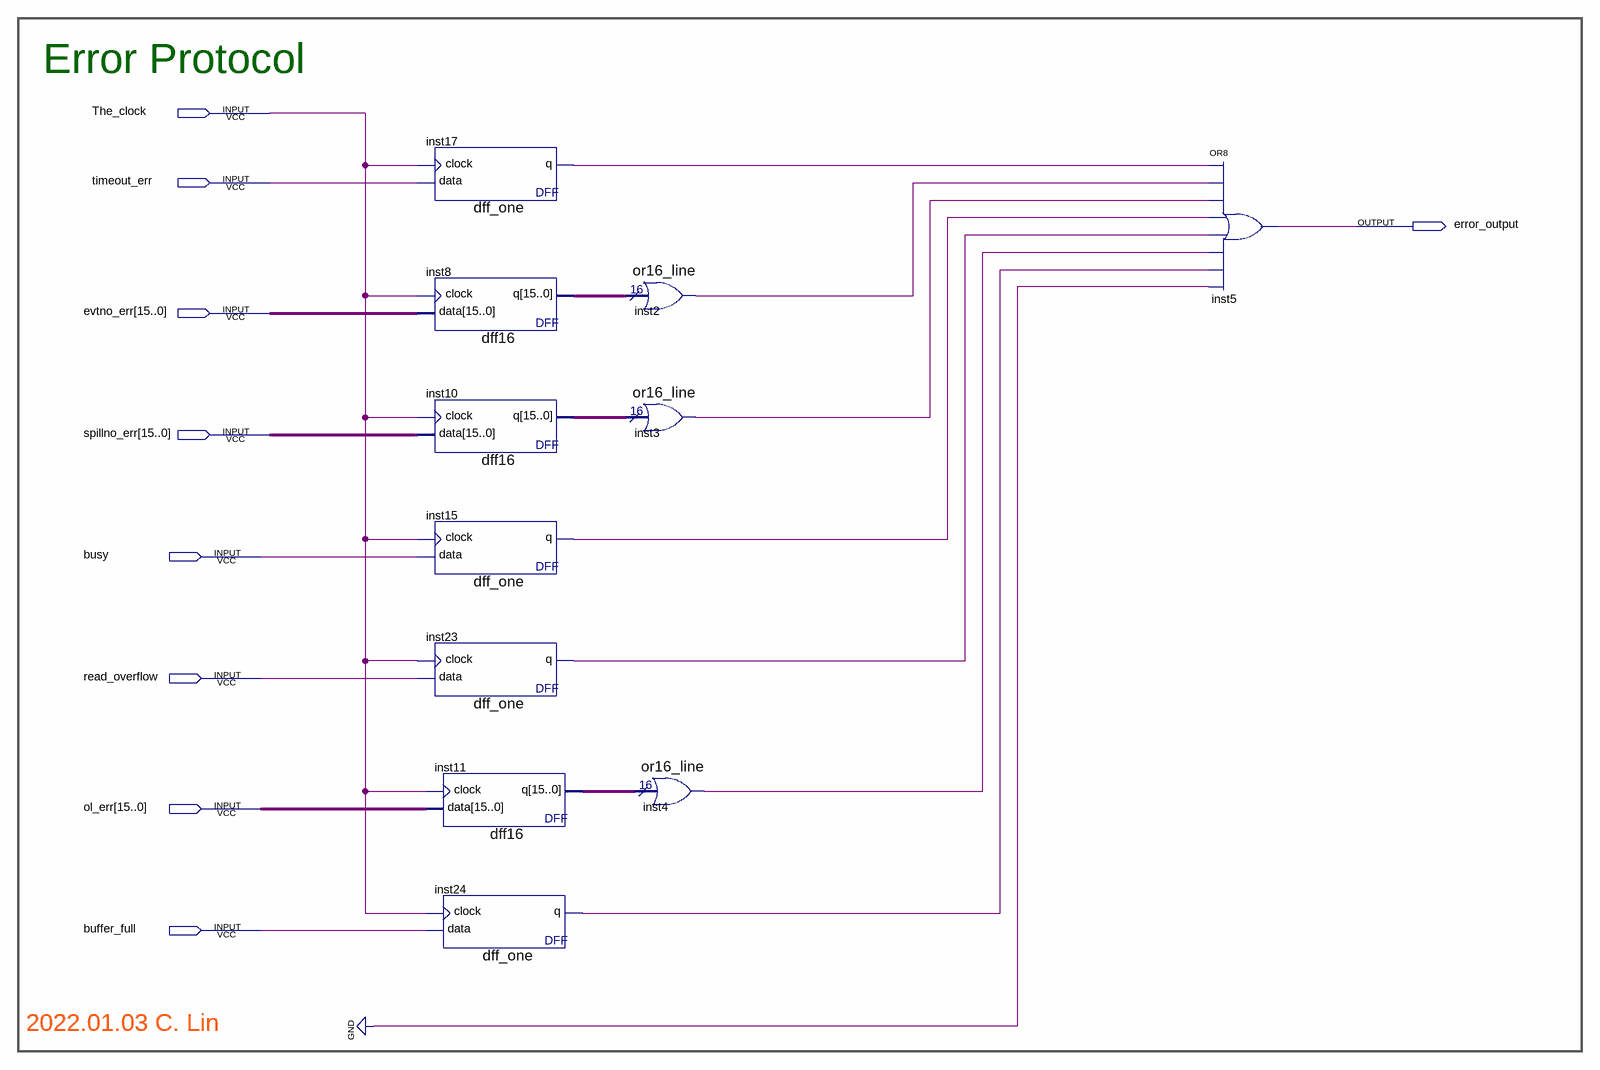
[diagram p0: schematic sheet]
// Quartus schematic error_protocol.bdf as structural Verilog: 11 symbols, 9 pins
module error_protocol (
  input  The_clock,
  input  timeout_err,
  input  [15:0] evtno_err,
  input  [15:0] spillno_err,
  input  busy,
  input  read_overflow,
  input  [15:0] ol_err,
  input  buffer_full,
  output error_output
);

  wire inst2_result, inst3_result, inst4_result, inst15_q, inst17_q, inst23_q, inst24_q;
  wire [15:0] inst8_q, inst10_q, inst11_q;

  dff_one inst17 (.data(timeout_err), .clock(The_clock), .q(inst17_q));
  dff16 inst8 (.data(evtno_err), .clock(The_clock), .q(inst8_q));
  dff16 inst10 (.data(spillno_err), .clock(The_clock), .q(inst10_q));
  dff_one inst15 (.data(busy), .clock(The_clock), .q(inst15_q));
  dff_one inst23 (.data(read_overflow), .clock(The_clock), .q(inst23_q));
  dff16 inst11 (.data(ol_err), .clock(The_clock), .q(inst11_q));
  dff_one inst24 (.data(buffer_full), .clock(The_clock), .q(inst24_q));
  or16_line inst2 (.data(inst8_q), .result(inst2_result));
  or16_line inst3 (.data(inst10_q), .result(inst3_result));
  or16_line inst4 (.data(inst11_q), .result(inst4_result));
  or inst5 (error_output, inst17_q, inst2_result, inst3_result, inst15_q, inst23_q, inst4_result, inst24_q, 1'b0);

  // Notes on the sheet:
  //   Error Protocol
  //   2022.01.03 C. Lin
endmodule
